# EAGLE schematic Teensy3_2_4IN_4OUTmcp4628 (EAGLE 9.5.1)

## Sheet 1 of 2: IO Conditioning
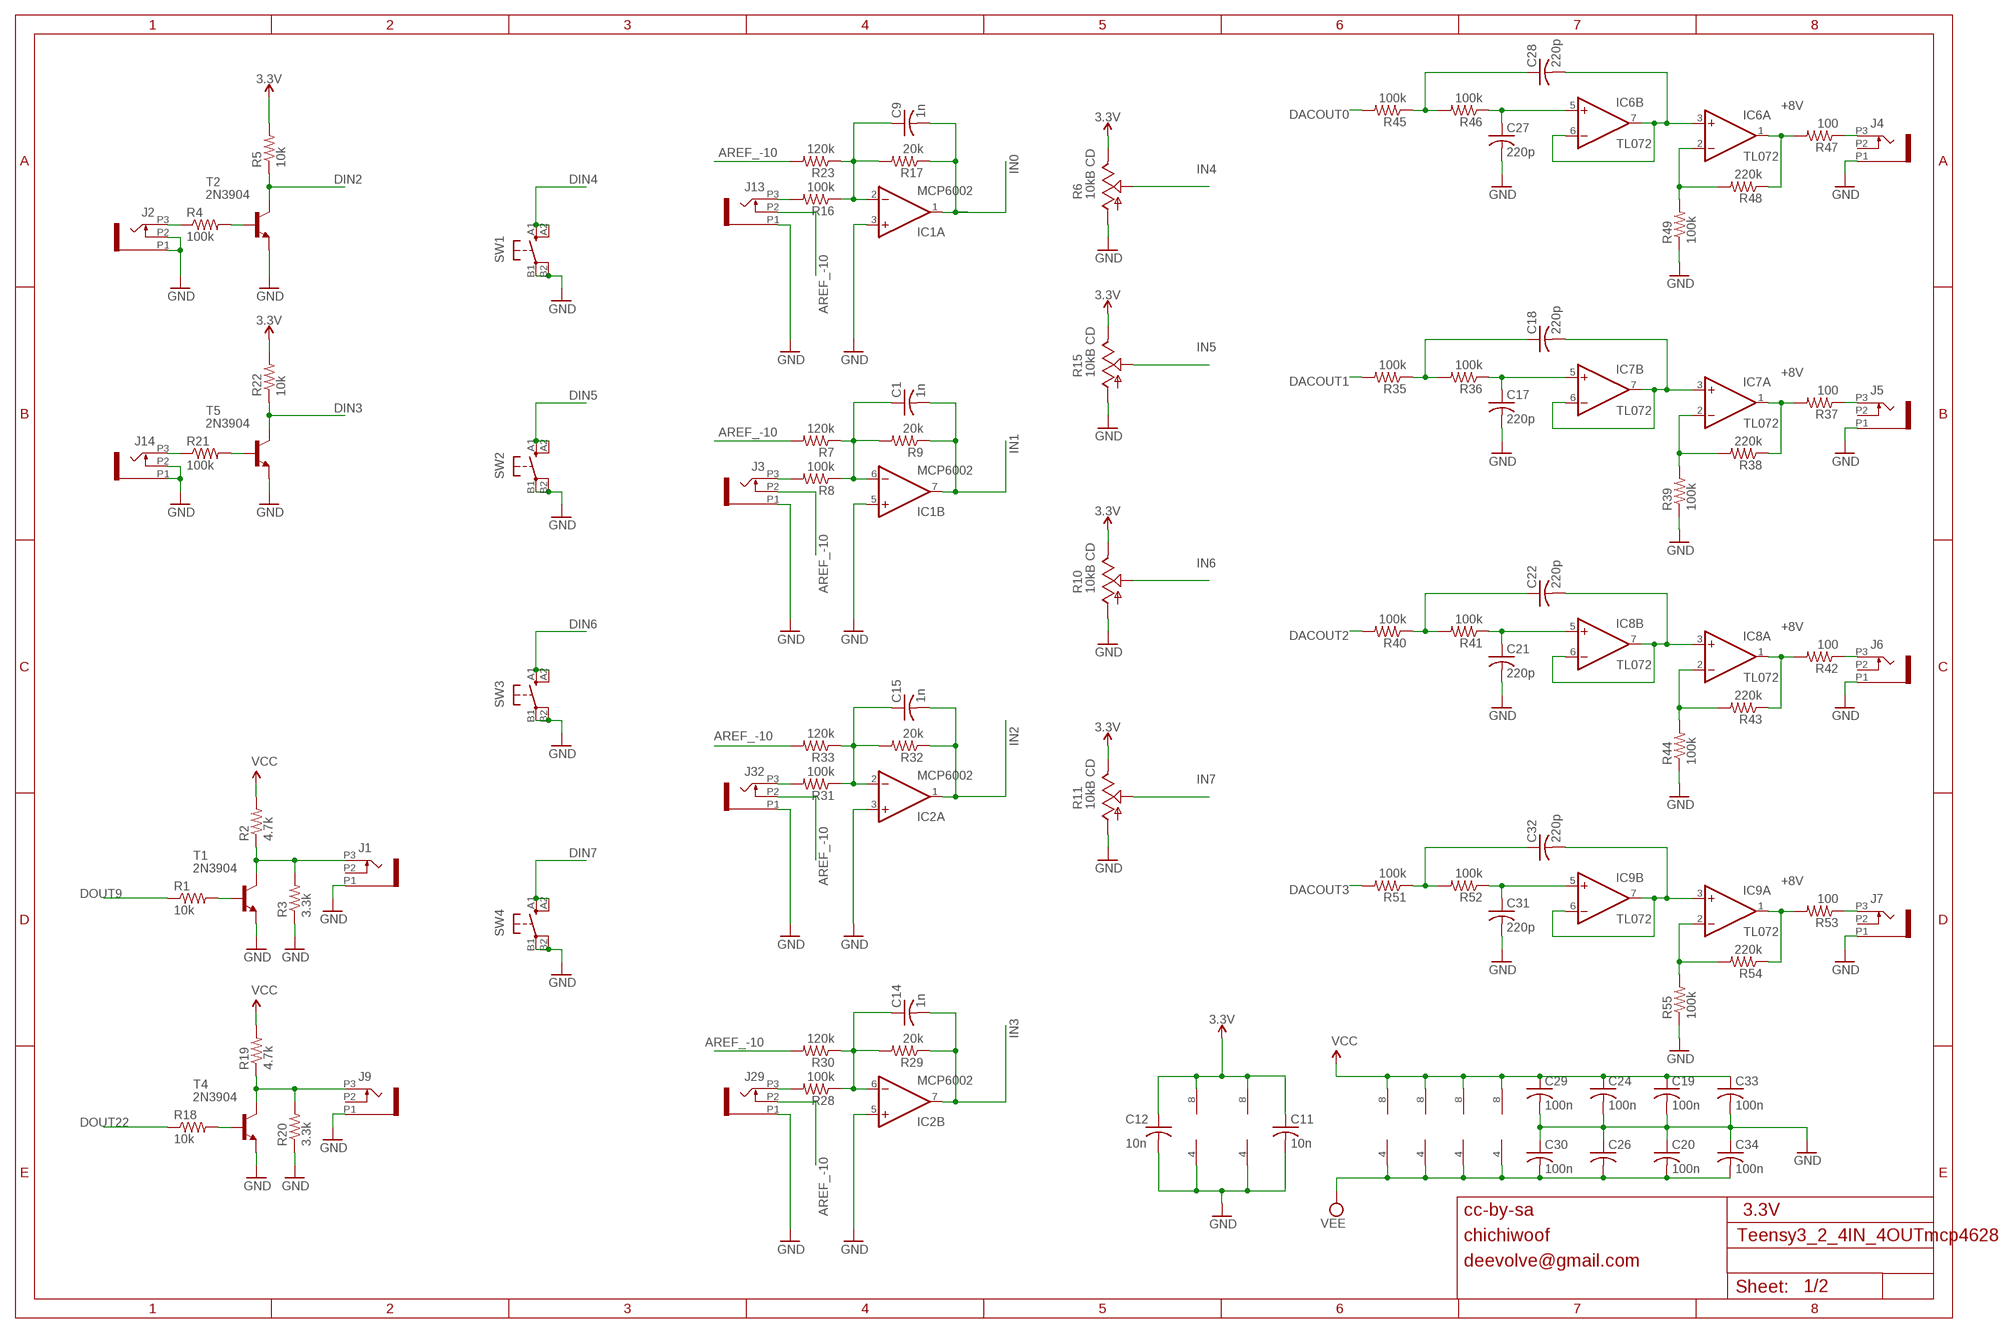
[diagram p0: schematic, sheet 1]

### Parts
C1  1n  C-US050-025X075  [C050-025X075]
C9  1n  C-US050-025X075  [C050-025X075]
C11  10n  C-US050-025X075  [C050-025X075]
C12  10n  C-US050-025X075  [C050-025X075]
C14  1n  C-US050-025X075  [C050-025X075]
C15  1n  C-US050-025X075  [C050-025X075]
C17  220p  C-US050-025X075  [C050-025X075]
C18  220p  C-US050-025X075  [C050-025X075]
C19  100n  C-US050-025X075  [C050-025X075]
C20  100n  C-US050-025X075  [C050-025X075]
C21  220p  C-US050-025X075  [C050-025X075]
C22  220p  C-US050-025X075  [C050-025X075]
C24  100n  C-US050-025X075  [C050-025X075]
C26  100n  C-US050-025X075  [C050-025X075]
C27  220p  C-US050-025X075  [C050-025X075]
C28  220p  C-US050-025X075  [C050-025X075]
C29  100n  C-US050-025X075  [C050-025X075]
C30  100n  C-US050-025X075  [C050-025X075]
C31  220p  C-US050-025X075  [C050-025X075]
C32  220p  C-US050-025X075  [C050-025X075]
C33  100n  C-US050-025X075  [C050-025X075]
C34  100n  C-US050-025X075  [C050-025X075]
IC1  MCP6002  TL072D  [SO08]
IC2  MCP6002  TL072D  [SO08]
IC6  TL072  TL072D  [SO08]
IC7  TL072  TL072D  [SO08]
IC8  TL072  TL072D  [SO08]
IC9  TL072  TL072D  [SO08]
J1  PJ301_THONKICONN6  [WQP_PJ_301M6]
J2  PJ301_THONKICONN6  [WQP_PJ_301M6]
J3  PJ301_THONKICONN6  [WQP_PJ_301M6]
J4  PJ301_THONKICONN6  [WQP_PJ_301M6]
J5  PJ301_THONKICONN6  [WQP_PJ_301M6]
J6  PJ301_THONKICONN6  [WQP_PJ_301M6]
J7  PJ301_THONKICONN6  [WQP_PJ_301M6]
J9  PJ301_THONKICONN6  [WQP_PJ_301M6]
J13  PJ301_THONKICONN6  [WQP_PJ_301M6]
J14  PJ301_THONKICONN6  [WQP_PJ_301M6]
J29  PJ301_THONKICONN6  [WQP_PJ_301M6]
J32  PJ301_THONKICONN6  [WQP_PJ_301M6]
R1  10k  R-US_0204/7  [0204/7]
R2  4.7k  R-US_0204/7  [0204/7]
R3  3.3k  R-US_0204/7  [0204/7]
R4  100k  R-US_0204/7  [0204/7]
R5  10k  R-US_0204/7  [0204/7]
R6  10kB CD  POT_USVERTICAL_PS  [ALPS_POT_VERTICAL_PS]
R7  120k  R-US_0204/7  [0204/7]
R8  100k  R-US_0204/7  [0204/7]
R9  20k  R-US_0204/7  [0204/7]
R10  10kB CD  POT_USVERTICAL_PS  [ALPS_POT_VERTICAL_PS]
R11  10kB CD  POT_USVERTICAL_PS  [ALPS_POT_VERTICAL_PS]
R15  10kB CD  POT_USVERTICAL_PS  [ALPS_POT_VERTICAL_PS]
R16  100k  R-US_0204/7  [0204/7]
R17  20k  R-US_0204/7  [0204/7]
R18  10k  R-US_0204/7  [0204/7]
R19  4.7k  R-US_0204/7  [0204/7]
R20  3.3k  R-US_0204/7  [0204/7]
R21  100k  R-US_0204/7  [0204/7]
R22  10k  R-US_0204/7  [0204/7]
R23  120k  R-US_0204/7  [0204/7]
R28  100k  R-US_0204/7  [0204/7]
R29  20k  R-US_0204/7  [0204/7]
R30  120k  R-US_0204/7  [0204/7]
R31  100k  R-US_0204/7  [0204/7]
R32  20k  R-US_0204/7  [0204/7]
R33  120k  R-US_0204/7  [0204/7]
R35  100k  R-US_0204/7  [0204/7]
R36  100k  R-US_0204/7  [0204/7]
R37  100  R-US_0204/7  [0204/7]
R38  220k  R-US_0204/7  [0204/7]
R39  100k  R-US_0204/7  [0204/7]
R40  100k  R-US_0204/7  [0204/7]
R41  100k  R-US_0204/7  [0204/7]
R42  100  R-US_0204/7  [0204/7]
R43  220k  R-US_0204/7  [0204/7]
R44  100k  R-US_0204/7  [0204/7]
R45  100k  R-US_0204/7  [0204/7]
R46  100k  R-US_0204/7  [0204/7]
R47  100  R-US_0204/7  [0204/7]
R48  220k  R-US_0204/7  [0204/7]
R49  100k  R-US_0204/7  [0204/7]
R51  100k  R-US_0204/7  [0204/7]
R52  100k  R-US_0204/7  [0204/7]
R53  100  R-US_0204/7  [0204/7]
R54  220k  R-US_0204/7  [0204/7]
R55  100k  R-US_0204/7  [0204/7]
SW1  D6R  [D6R]
SW2  D6R  [D6R]
SW3  D6R  [D6R]
SW4  D6R  [D6R]
T1  2N3904  [TO92]
T2  2N3904  [TO92]
T4  2N3904  [TO92]
T5  2N3904  [TO92]

### Nets
3.3V [+3V3]: C11.1 C12.1 IC1.8(P:V+) IC2.8(P:V+) R5.2 R6.P$1(E) R10.P$1(E) R11.P$1(E) R15.P$1(E) R22.2 ; also sheet 2
AREF_-10 [-10V]: J3.P2 J13.P2 J29.P2 J32.P2 R7.2 R23.2 R30.2 R33.2 ; also sheet 2
DACOUT0: R45.2 ; also sheet 2
DACOUT1: R35.2 ; also sheet 2
DACOUT2: R40.2 ; also sheet 2
DACOUT3: R51.2 ; also sheet 2
DIN2: R5.1 T2.1(C) ; also sheet 2
DIN3: R22.1 T5.1(C) ; also sheet 2
DIN4: SW1.A1(S) SW1.A2(S1) ; also sheet 2
DIN5: SW2.A1(S) SW2.A2(S1) ; also sheet 2
DIN6: SW3.A1(S) SW3.A2(S1) ; also sheet 2
DIN7: SW4.A1(S) SW4.A2(S1) ; also sheet 2
DOUT9: R1.1 ; also sheet 2
DOUT22: R18.1 ; also sheet 2
GND [GND]: C11.2 C12.2 C17.2 C19.2 C20.1 C21.2 C24.2 C26.1 C27.2 C29.2 C30.1 C31.2 C33.2 C34.1 IC1.3(A:+IN) IC1.4(P:V-) IC1.5(B:+IN) IC2.3(A:+IN) IC2.4(P:V-) IC2.5(B:+IN) J1.P1 J2.P1 J2.P2 J3.P1 J4.P1 J5.P1 J6.P1 J7.P1 J9.P1 J13.P1 J14.P1 J14.P2 J29.P1 J32.P1 R3.1 R6.P$3(A) R10.P$3(A) R11.P$3(A) R15.P$3(A) R20.1 R39.1 R44.1 R49.1 R55.1 SW1.B1(P) SW1.B2(P1) SW2.B1(P) SW2.B2(P1) SW3.B1(P) SW3.B2(P1) SW4.B1(P) SW4.B2(P1) T1.3(E) T2.3(E) T4.3(E) T5.3(E) ; also sheet 2
IN0: C9.2 IC1.1(A:OUT) R17.1 ; also sheet 2
IN1: C1.2 IC1.7(B:OUT) R9.1 ; also sheet 2
IN2: C15.2 IC2.1(A:OUT) R32.1 ; also sheet 2
IN3: C14.2 IC2.7(B:OUT) R29.1 ; also sheet 2
IN4: R6.P$2(S) ; also sheet 2
IN5: R15.P$2(S) ; also sheet 2
IN6: R10.P$2(S) ; also sheet 2
IN7: R11.P$2(S) ; also sheet 2
N$1: R1.2 T1.2(B)
N$2: J1.P3 R2.1 R3.2 T1.1(C)
N$5: J3.P3 R8.2
N$6: J13.P3 R16.2
N$9: C1.1 IC1.6(B:-IN) R7.1 R8.1 R9.2
N$11: C9.1 IC1.2(A:-IN) R16.1 R17.2 R23.1
N$12: R18.2 T4.2(B)
N$13: J9.P3 R19.1 R20.2 T4.1(C)
N$16: J14.P3 R21.1
N$17: R21.2 T5.2(B)
N$22: J4.P3 R47.1
N$28: C28.2 IC6.3(A:+IN) IC6.6(B:-IN) IC6.7(B:OUT)
N$29: C27.1 IC6.5(B:+IN) R46.1
N$30: C28.1 R45.1 R46.2
N$31: J29.P3 R28.2
N$32: C14.1 IC2.6(B:-IN) R28.1 R29.2 R30.1
N$34: J32.P3 R31.2
N$35: C15.1 IC2.2(A:-IN) R31.1 R32.2 R33.1
N$38: C18.2 IC7.3(A:+IN) IC7.6(B:-IN) IC7.7(B:OUT)
N$39: C17.1 IC7.5(B:+IN) R36.1
N$40: C18.1 R35.1 R36.2
N$41: IC7.2(A:-IN) R38.2 R39.2
N$42: IC7.1(A:OUT) R37.2 R38.1
N$43: IC6.2(A:-IN) R48.2 R49.2
N$44: IC6.1(A:OUT) R47.2 R48.1
N$49: C22.2 IC8.3(A:+IN) IC8.6(B:-IN) IC8.7(B:OUT)
N$50: C21.1 IC8.5(B:+IN) R41.1
N$51: C22.1 R40.1 R41.2
N$52: IC8.2(A:-IN) R43.2 R44.2
N$53: IC8.1(A:OUT) R42.2 R43.1
N$54: C32.2 IC9.3(A:+IN) IC9.6(B:-IN) IC9.7(B:OUT)
N$55: C31.1 IC9.5(B:+IN) R52.1
N$57: J2.P3 R4.1
N$58: C32.1 R51.1 R52.2
N$59: IC9.2(A:-IN) R54.2 R55.2
N$60: IC9.1(A:OUT) R53.2 R54.1
N$66: R4.2 T2.2(B)
UNI_OUT1: J6.P3 R42.1
UNI_OUT2: J7.P3 R53.1
UNI_OUT3: J5.P3 R37.1
VCC [VCC]: C19.1 C24.1 C29.1 C33.1 IC6.8(P:V+) IC7.8(P:V+) IC8.8(P:V+) IC9.8(P:V+) R2.2 R19.2 ; also sheet 2
VEE [VEE]: C20.2 C26.2 C30.2 C34.2 IC6.4(P:V-) IC7.4(P:V-) IC8.4(P:V-) IC9.4(P:V-) ; also sheet 2
Unconnected: J1.P2 J4.P2 J5.P2 J6.P2 J7.P2 J9.P2

### Notes on the sheet
- +8V
- +8V
- +8V
- +8V
- cc-by-sa | 3.3V
- chichiwoof
- deevolve@gmail.com

## Sheet 2 of 2: Power and Arduino Pins
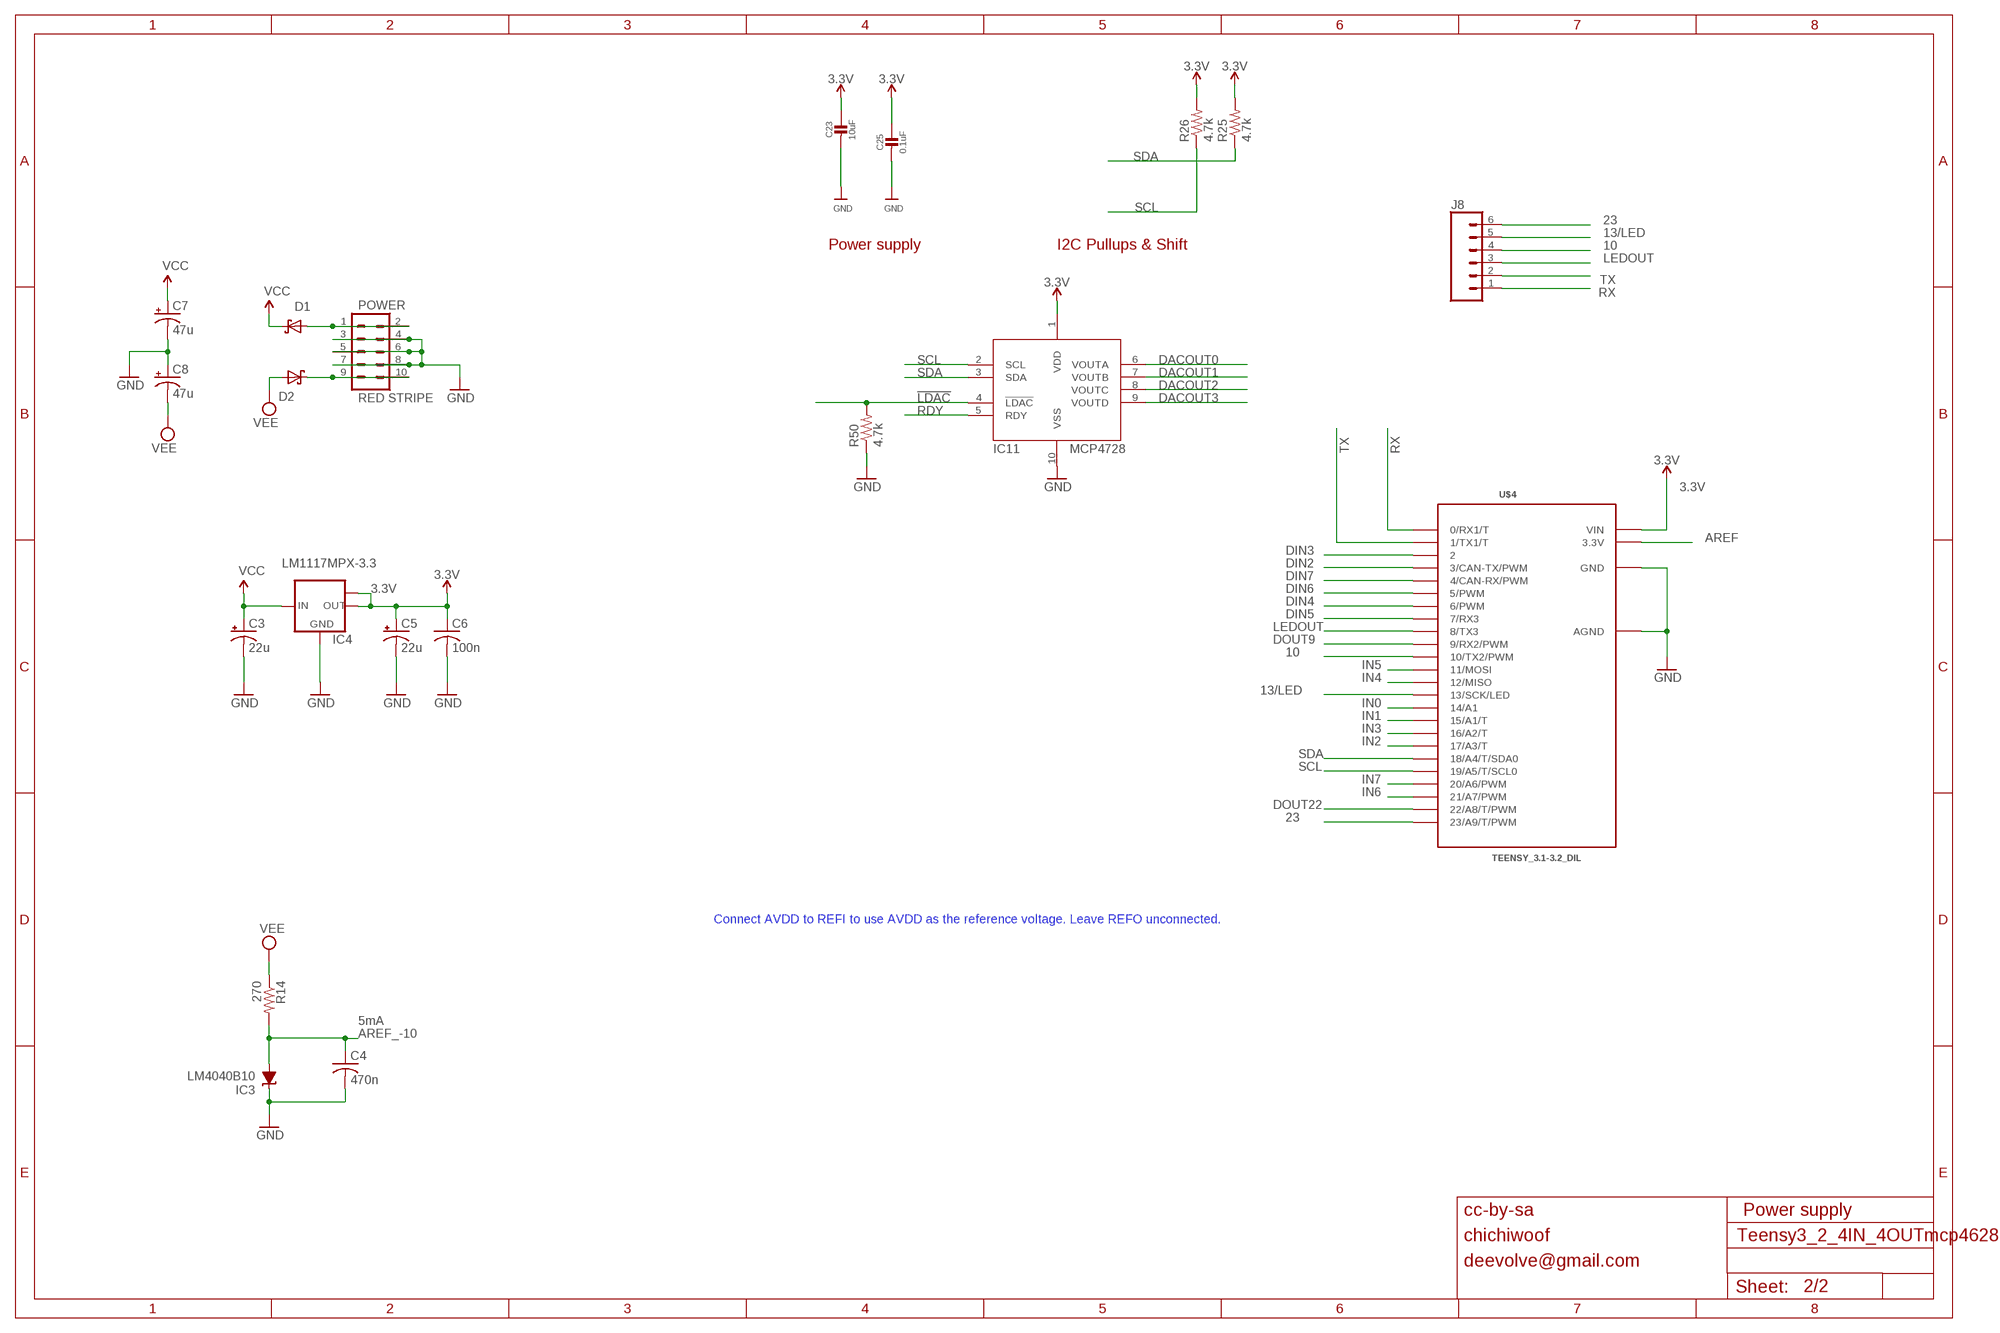
[diagram p1: schematic, sheet 2]

### Parts
C3  22u  CPOL-USE2.5-7  [E2,5-7]
C4  470n  C-US050-025X075  [C050-025X075]
C5  22u  CPOL-USE2.5-7  [E2,5-7]
C6  100n  C-US050-025X075  [C050-025X075]
C7  47u  CPOL-USE2.5-7  [E2,5-7]
C8  47u  CPOL-USE2.5-7  [E2,5-7]
C23  10uF  CAP_CERAMIC0805-NOOUTLINE  [0805-NO]
C25  0.1uF  CAP_CERAMIC0603_NO  [0603-NO]
D1  1N5819  SCHOTTKY-DIODEDO41  [DO41-10]
D2  1N5819  SCHOTTKY-DIODEDO41  [DO41-10]
IC3  LM4040B10  LM4041B12DBZ  [DBZ_R-PDSO-G3]
IC4  LM1117MPX-3.3  [SOT223]
IC11  MCP4728  [MSOP10]
J8  CONN_06SILK_FEMALE_PTH  [1X06]
POWER  RED STRIPE  M05X2PTH  [AVR_ICSP]
R14  270  R-US_0204/7  [0204/7]
R25  4.7k  R-US_0204/7  [0204/7]
R26  4.7k  R-US_0204/7  [0204/7]
R50  4.7k  R-US_0204/7  [0204/7]
U$4  TEENSY_3.1-3.2_DIL  [TEENSY_3.0-3.2&LC_DIL]

### Nets
3.3V [+3V3]: C5.+ C6.1 C23.1 C25.1 IC4.2(OUT) IC4.TAB(OUT1) IC11.1(VDD) R25.2 R26.2 U$4.VIN ; also sheet 1
10: J8.4 U$4.10(10/TX2/PWM)
13/LED: J8.5 U$4.13(13/SCK/LED)
23: J8.6 U$4.23/A9(23/A9/T/PWM)
!LDAC: IC11.4(!LDAC) R50.2
+12 [VCC]: D1.A POWER.1 POWER.2
-12 [VEE]: D2.C POWER.9 POWER.10
AREF: U$4.3.3V
AREF_-10 [-10V]: C4.1 IC3.2(A) R14.2 ; also sheet 1
DACOUT0: IC11.6(VOUTA) ; also sheet 1
DACOUT1: IC11.7(VOUTB) ; also sheet 1
DACOUT2: IC11.8(VOUTC) ; also sheet 1
DACOUT3: IC11.9(VOUTD) ; also sheet 1
DIN2: U$4.3(3/CAN-TX/PWM) ; also sheet 1
DIN3: U$4.2 ; also sheet 1
DIN4: U$4.6(6/PWM) ; also sheet 1
DIN5: U$4.7(7/RX3) ; also sheet 1
DIN6: U$4.5(5/PWM) ; also sheet 1
DIN7: U$4.4(4/CAN-RX/PWM) ; also sheet 1
DOUT9: U$4.9(9/RX2/PWM) ; also sheet 1
DOUT22: U$4.22/A8(22/A8/T/PWM) ; also sheet 1
GND [GND]: C3.- C4.2 C5.- C6.2 C7.- C8.+ C23.2 C25.2 IC3.1(C) IC4.1(GND) IC11.10(VSS) POWER.3 POWER.4 POWER.5 POWER.6 POWER.7 POWER.8 R50.1 U$4.AGND U$4.GND ; also sheet 1
IN0: U$4.14/A0(14/A1) ; also sheet 1
IN1: U$4.15/A1(15/A1/T) ; also sheet 1
IN2: U$4.17/A3(17/A3/T) ; also sheet 1
IN3: U$4.16/A2(16/A2/T) ; also sheet 1
IN4: U$4.12(12/MISO) ; also sheet 1
IN5: U$4.11(11/MOSI) ; also sheet 1
IN6: U$4.21/A7(21/A7/PWM) ; also sheet 1
IN7: U$4.20/A6(20/A6/PWM) ; also sheet 1
LEDOUT: J8.3 U$4.8(8/TX3)
RDY: IC11.5(RDY)
RX: J8.1 U$4.0(0/RX1/T)
SCL: IC11.2(SCL) R26.1 U$4.19/A5(19/A5/T/SCL0)
SDA: IC11.3(SDA) R25.1 U$4.18/A4(18/A4/T/SDA0)
TX: J8.2 U$4.1(1/TX1/T)
VCC [VCC]: C3.+ C7.+ D1.C IC4.3(IN) ; also sheet 1
VEE [VEE]: C8.- D2.A R14.1 ; also sheet 1

### Notes on the sheet
- Power supply | I2C Pullups & Shift
- Connect AVDD to REFI to use AVDD as the reference voltage. Leave REFO unconnected.
- 5mA
- cc-by-sa | Power supply
- chichiwoof
- deevolve@gmail.com

## Library data of the parts
C1 C4 C6 C9 C11 C12 C14 C15 C17-C22 C24 C26-C34 = rcl:C-US: CAPACITOR, American symbol; SPICEPREFIX: C
C3 C5 C7 C8 = rcl:CPOL-US: POLARIZED CAPACITOR, American symbol; SPICEPREFIX: C
C23 C25 = microbuilder:CAP_CERAMIC: Ceramic Capacitors For new designs, use the packages preceded by an '_' character since they are more reliable: The following footprints should be used on most boards: _0402 - Standard footprint for regular board layouts _0603 - Standard footprint for regular board layouts _0805 - Standard footprint for regular board layouts _1206 - Standard footprint for regular board layouts For extremely tight-pitch boards where space is at a premium, the following 'micro-pitch' footprints can be used (smaller pads, no silkscreen outline, etc.): _0402MP - Micro-pitch footprint for very dense/compact boards _0603MP - Micro-pitch footprint for very dense/compact boards _0805MP - Micro-pitch footprint for very dense/compact boards _1206MP - Micro-pitch footprint for very dense/compact boards
D1 D2 = adafruit:SCHOTTKY-DIODE: Schottky Diode
IC1 IC2 IC6-IC9 = linear:TL072: OP AMP
IC3 = texas:LM4041: PRECISION MICROPOWER SHUNT VOLTAGE REFERENCE Source: http://focus.ti.com/lit/ds/slcs146e/slcs146e.pdf
IC4 = lm1117:LM1117MPX-*
IC11 = microbuilder:MCP4728
J1-J7 J9 J13 J14 J29 J32 = og-pj301_variations:PJ301_THONKICONN
J8 = SparkFun-Connectors:CONN_06: Multi connection point. Often used as Generic Header-pin footprint for 0.1 inch spaced/style header connections On any of the 0.1 inch spaced packages, you can populate with these: Break Away Headers - Straight <https://www.sparkfun.com/products/116> (PRT-00116) Break Away Male Headers - Right Angle <https://www.sparkfun.com/products/553> (PRT-00553) Female Headers <https://www.sparkfun.com/products/115> (PRT-00115) Break Away Headers - Machine Pin <https://www.sparkfun.com/products/117> (PRT-00117) Break Away Female Headers - Swiss Machine Pin <https://www.sparkfun.com/products/743> (PRT-00743) Arduino Stackable Header - 6 Pin <https://www.sparkfun.com/products/9280> (PRT-09280) For SCREWTERMINALS and SPRING TERMINALS visit here: Screw Terimnals on SparkFun.com <https://www.sparkfun.com/search/results?term=Screw+Terminals> (5mm/3.5mm/2.54mm spacing) This device is also useful as a general connection point to wire up your design to another part of your project. Our various solder wires solder well into these plated through hole pads. Hook-Up Wire - Assortment (Stranded, 22 AWG) <https://www.sparkfun.com/products/11375> (PRT-11375) Hook-Up Wire - Assortment (Solid Core, 22 AWG) <https://www.sparkfun.com/products/11367> (PRT-11367) View the entire wire category on our website here <https://www.sparkfun.com/categories/141>; PROD_ID: CONN-08437
POWER = og-header:M05X2: Header 5x2 Standard 10-pin dual row 0.1" header. Commonly used with AVR-ISP. Use with Spark Fun Electronics SKU: PRT-00778
R1-R5 R7-R9 R14 R16-R23 R25 R26 R28-R33 R35-R55 = rcl:R-US_: RESISTOR, American symbol; SPICEPREFIX: R
R6 R10 R11 R15 = pot-alps:POT_US
SW1-SW4 = og-switch:D6R: C&K D6R
T1 T2 T4 T5 = transistor:2N3904: NPN TRANSISTOR
U$4 = Teensy_3_and_LC_Series_Boards_v1.4:TEENSY_3.1-3.2_DIL: Teensy 3.1 or 3.2 in a DIL Layout.

## Net classes
0 default: width 0.254 mm, clearance 0.203 mm
1 GND: width 0.406 mm, clearance 0.254 mm to class 0, clearance 0.254 mm
2 +3V3: width 0.356 mm, clearance 0.152 mm to class 0, clearance 0.254 mm
3 -10V: width 0.356 mm, clearance 0.152 mm to class 0, clearance 0.254 mm
4 VCC: width 0.457 mm, clearance 0.152 mm to class 0, clearance 0.254 mm
5 VEE: width 0.457 mm, clearance 0.152 mm to class 0, clearance 0.254 mm